# EAGLE design lcd-interface (EAGLE 5.02)
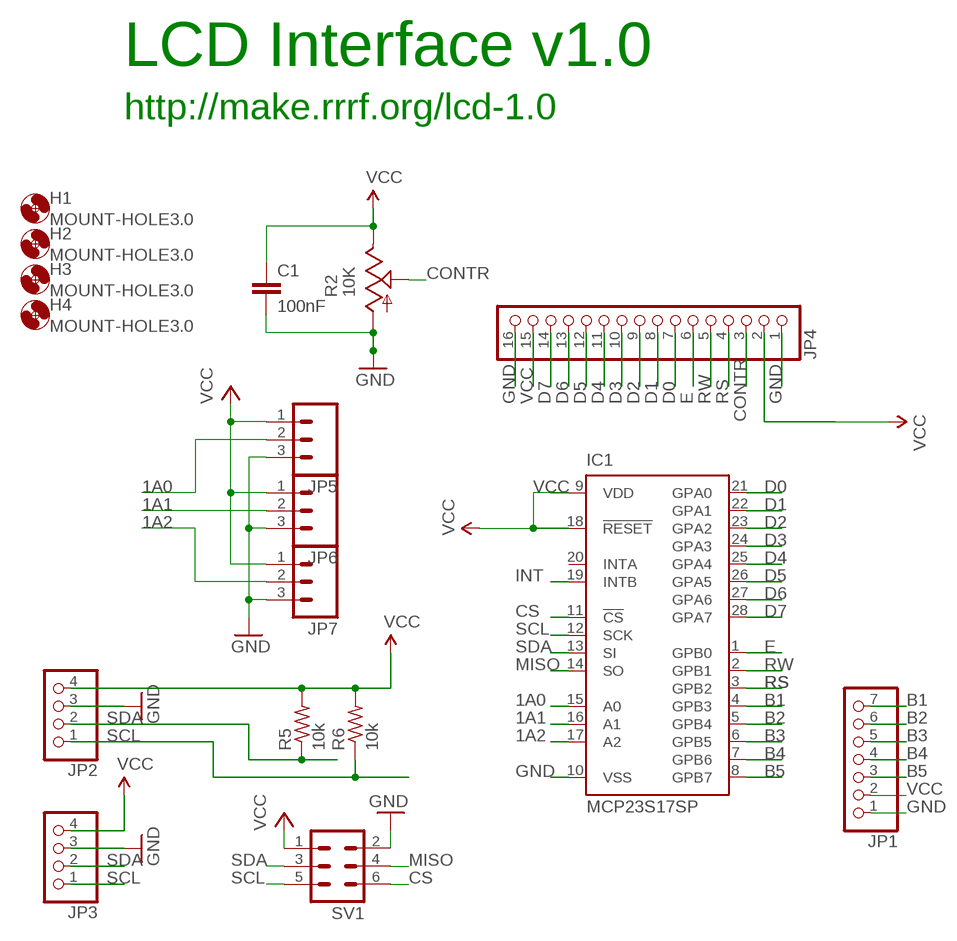
[diagram p0: schematic, sheet 1]

## Parts
C1  100nF  C-EU050-030X075  [C050-030X075]
H1  MOUNT-HOLE3.0  [3,0]
H2  MOUNT-HOLE3.0  [3,0]
H3  MOUNT-HOLE3.0  [3,0]
H4  MOUNT-HOLE3.0  [3,0]
IC1  MCP23S17SP  [DIL28-3]
JP1  PINHD-1X7  [1X07]
JP2  PINHD-1X4  [1X04]
JP3  PINHD-1X4  [1X04]
JP4  PINHD-1X16  [1X16]
JP5  M03PTH  [1X03]
JP6  M03PTH  [1X03]
JP7  M03PTH  [1X03]
R2  10K  TRIM_US-B25P  [B25P]
R5  10k  R-US_0207/7  [0207/7]
R6  10k  R-US_0207/7  [0207/7]
SV1  ML6  [ML6]

## Nets
1A0: IC1.15(A0) JP5.2
1A1: IC1.16(A1) JP6.2
1A2: IC1.17(A2) JP7.2
B1: IC1.4(GPB3) JP1.7
B2: IC1.5(GPB4) JP1.6
B3: IC1.6(GPB5) JP1.5
B4: IC1.7(GPB6) JP1.4
B5: IC1.8(GPB7) JP1.3
CONTR: JP4.3 R2.S
CS: IC1.11(!CS) SV1.6
D0: IC1.21(GPA0) JP4.7
D1: IC1.22(GPA1) JP4.8
D2: IC1.23(GPA2) JP4.9
D3: IC1.24(GPA3) JP4.10
D4: IC1.25(GPA4) JP4.11
D5: IC1.26(GPA5) JP4.12
D6: IC1.27(GPA6) JP4.13
D7: IC1.28(GPA7) JP4.14
E: IC1.1(GPB0) JP4.6
GND: C1.2 IC1.10(VSS) JP1.1 JP2.3 JP3.3 JP4.1 JP4.16 JP5.3 JP6.3 JP7.3 R2.A SV1.2
INT: IC1.19(INTB)
MISO: IC1.14(SO) SV1.4
RS: IC1.3(GPB2) JP4.4
RW: IC1.2(GPB1) JP4.5
SCL: IC1.12(SCK) JP2.1 JP3.1 R6.1 SV1.5
SDA: IC1.13(SI) JP2.2 JP3.2 R5.1 SV1.3
VCC: C1.1 IC1.9(VDD) IC1.18(!RESET) JP1.2 JP2.4 JP3.4 JP4.2 JP4.15 JP5.1 JP6.1 JP7.1 R2.E R5.2 R6.2 SV1.1
Unconnected: IC1.20(INTA)

## Notes on the sheet
- LCD Interface v1.0
- http://make.rrrf.org/lcd-1.0

## Library data of the parts
C1 = rcl:C-EU: CAPACITOR, European symbol
H1-H4 = holes:MOUNT-HOLE: MOUNTING HOLE with drill center marker
IC1 = microchip:MCP23S17: http://ww1.microchip.com/downloads/en/DeviceDoc/21952a.pdf Source: http://ww1.microchip.com/downloads/en/DeviceDoc/21952a.pdf
JP1 = pinhead:PINHD-1X7: PIN HEADER
JP2 JP3 = pinhead:PINHD-1X4: PIN HEADER
JP4 = pinhead:PINHD-1X16: PIN HEADER
JP5-JP7 = SparkFun:M03: Header 3 Standard 3-pin 0.1" header. Use with straight break away headers (SKU : PRT-00116), right angle break away headers (PRT-00553), swiss pins (PRT-00743), machine pins (PRT-00117), and female headers (PRT-00115). Molex polarized connector foot print use with SKU : PRT-08232 with associated crimp pins and housings.
R2 = pot:TRIM_US-: POTENTIOMETER
R5 R6 = resistor:R-US_: RESISTOR, American symbol
SV1 = con-harting-ml:ML6: HARTING

## Board
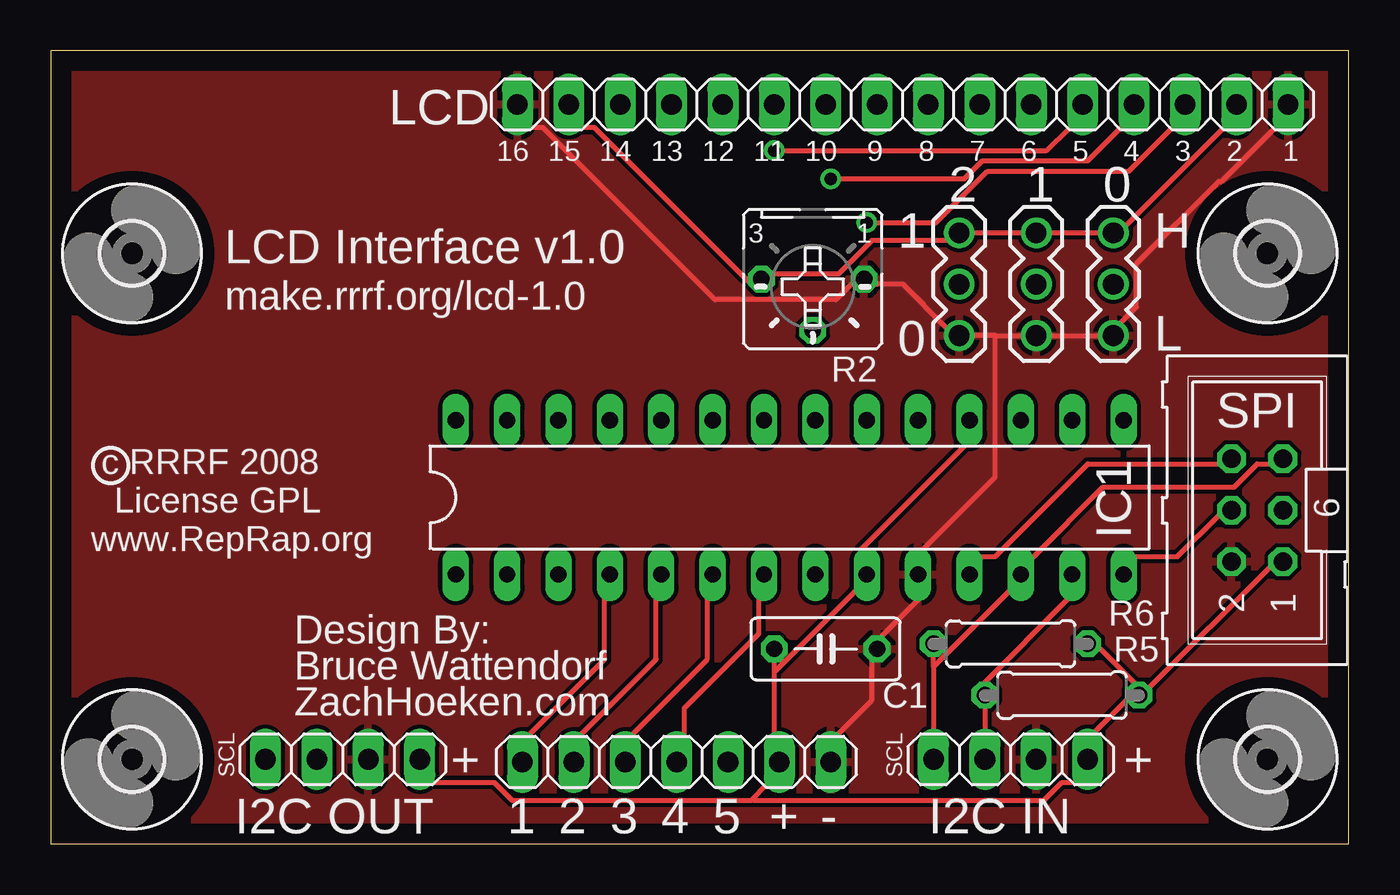
[diagram p1: board, top side]
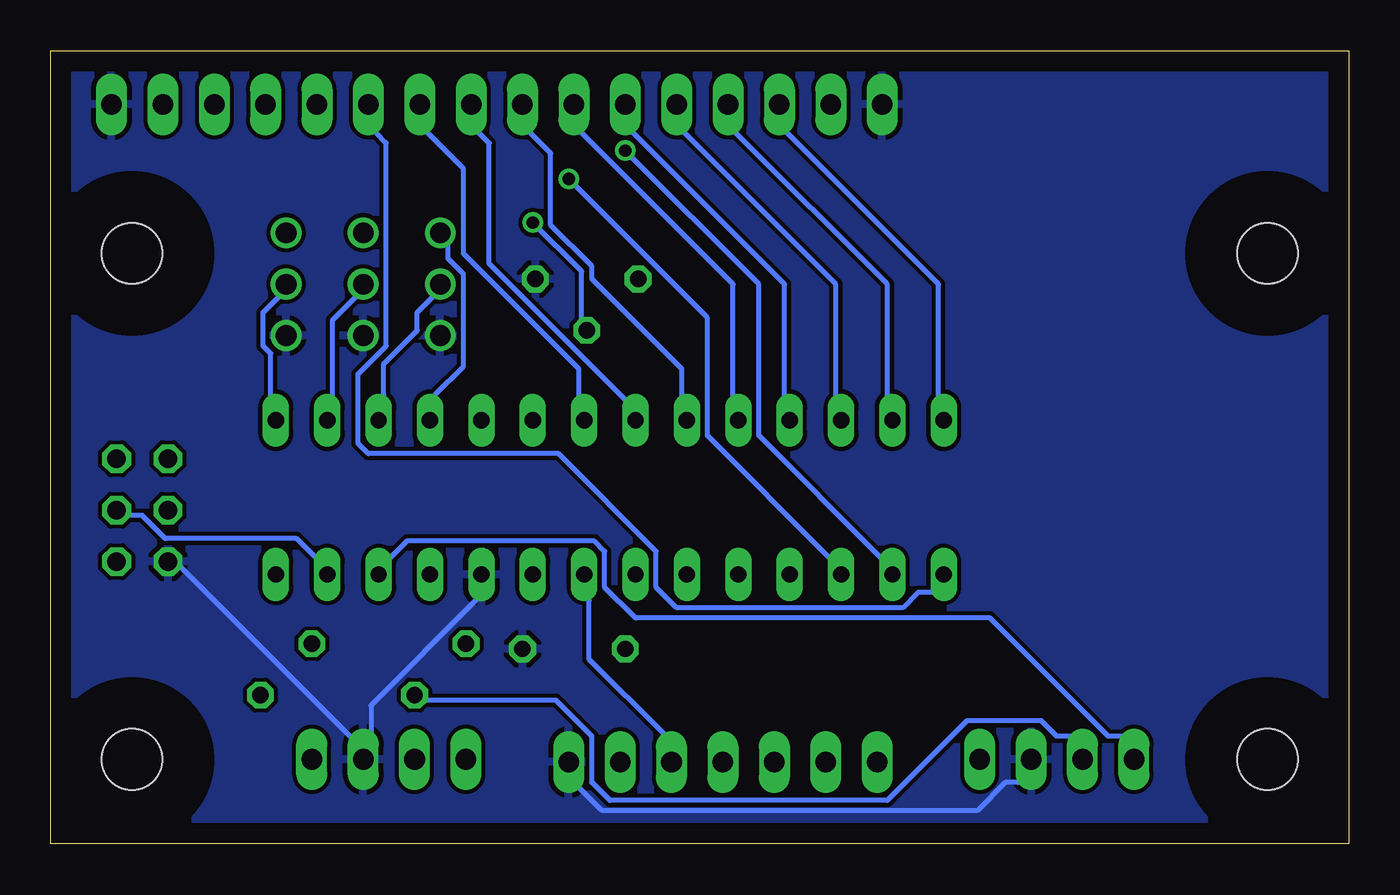
[diagram p2: board, bottom side, seen from below]

Size 64.19 x 39.23 mm. Coordinates in mm from the lower left corner, seen from the top.
Outline: 0,0 64.19,0 64.19,39.23 0,39.23 0,0
Copper layers (1*16): Top 0.035mm / dielectric 1.5mm / Bottom 0.035mm
Design rules "default": minimum track width 10mil, minimum drill 24mil, track to track 8mil, track to pad 8mil, pad to pad 8mil, via to via 8mil, smd to smd 8mil, copper to edge 40mil, drill to drill 8mil, minimum pad ring 10mil, minimum via ring 8mil, stop-mask expansion 4mil, vias tented up to drill 0mil, thermal gap 10mil

### Footprints (pad centres in the part's own frame; a part is rotated, then mirrored left to right if it is on the bottom)
C050-030X075 = drill 0.813 octagon: 1 -2.54,0; 2 2.54,0
3,0 = hole 3: 0,0
DIL28-3 = drill 0.813 long: 1 -16.51,-3.81; 2 -13.97,-3.81; 3 -11.43,-3.81; 4 -8.89,-3.81; 5 -6.35,-3.81; 6 -3.81,-3.81; 7 -1.27,-3.81; 8 1.27,-3.81; 9 3.81,-3.81; 10 6.35,-3.81; 11 8.89,-3.81; 12 11.43,-3.81; 13 13.97,-3.81; 14 16.51,-3.81; 15 16.51,3.81; 16 13.97,3.81; 17 11.43,3.81; 18 8.89,3.81; 19 6.35,3.81; 20 3.81,3.81; 21 1.27,3.81; 22 -1.27,3.81; 23 -3.81,3.81; 24 -6.35,3.81; 25 -8.89,3.81; 26 -11.43,3.81; 27 -13.97,3.81; 28 -16.51,3.81
1X07 = drill 1.016 long: 1 -7.62,0; 2 -5.08,0; 3 -2.54,0; 4 0,0; 5 2.54,0; 6 5.08,0; 7 7.62,0
1X04 = drill 1.016 long: 1 -3.81,0; 2 -1.27,0; 3 1.27,0; 4 3.81,0
1X16 = drill 1.016 long: 1 -19.05,0; 2 -16.51,0; 3 -13.97,0; 4 -11.43,0; 5 -8.89,0; 6 -6.35,0; 7 -3.81,0; 8 -1.27,0; 9 1.27,0; 10 3.81,0; 11 6.35,0; 12 8.89,0; 13 11.43,0; 14 13.97,0; 15 16.51,0; 16 19.05,0
1X03 = drill 1.016 round: 1 0,0; 2 2.54,0; 3 5.08,0
B25P = drill 0.813 octagon: A -2.54,0; E 2.54,0; S 0,2.54
0207/7 = drill 0.813 octagon: 1 -3.81,0; 2 3.81,0
ML6 = drill 0.914 octagon: 1 -2.54,-1.27; 2 -2.54,1.27; 3 0,-1.27; 4 0,1.27; 5 2.54,-1.27; 6 2.54,1.27

### Placement (x,y rotation side)
C1  38.32,9.65 0 top
H1  4.03,29.2 0 top
H2  4.03,4.19 0 top
H3  60.16,4.19 0 top
H4  60.16,29.2 0 top
IC1  36.54,17.14 0 top
JP1  30.95,4.06 180 top
JP2  47.46,4.19 0 top
JP3  14.44,4.19 0 top
JP4  42.13,36.57 180 top
JP5  52.54,30.22 270 top
JP6  48.73,30.22 270 top
JP7  44.92,30.22 270 top
R2  37.68,27.94 180 top
R5  50,7.36 0 top
R6  47.46,9.9 0 top
SV1  59.65,16.51 90 top

### Tracks (layer width: path | path; a pad name or v marks a point on that pad's centre or on a via)
1A0
  Bottom 0.254: IC1.15 53.3,22.22 53.3,24.25 53.68,24.63 53.68,26.28 52.92,27.05 JP5.2
1A1
  Bottom 0.254: IC1.16 50.25,22.22 50.25,25.9 49.11,27.05 JP6.2
1A2
  Bottom 0.254: IC1.17 47.71,22.22 47.71,23.74 46.06,25.4 46.06,26.28 45.3,27.05 JP7.2
B1
  Top 0.254: IC1.4 27.39,12.06 27.39,9.14 23.71,5.46 JP1.7
B2
  Top 0.254: IC1.5 29.93,12.06 29.93,9.14 26.25,5.46 JP1.6
B3
  Top 0.254: IC1.6 32.47,12.06 32.47,9.14 28.79,5.46 JP1.5
B4
  Top 0.254: IC1.7 35.01,12.06 35.01,10.41 31.33,6.73 31.33,5.46 JP1.4
B5
  Bottom 0.254: IC1.8 37.55,12.06 37.55,9.14 33.87,5.46 JP1.3
CONTR  (via drill 0.61)
  Top 0.254: v40.35,30.73 43.78,30.73 46.32,33.27 53.3,33.27 55.46,35.43 JP4.3
  Bottom 0.254: v40.35,30.73 37.94,28.32 37.94,26.03 R2.S
CS
  Top 0.254: IC1.11 46.06,14.22 46.7,14.22 51.27,18.79 57.75,18.79 SV1.6
D0
  Bottom 0.254: IC1.21 38.06,22.22 38.06,23.49 43.78,29.2 43.78,33.4 45.55,35.17 JP4.7
D1
  Bottom 0.254: IC1.22 35.78,21.97 42.51,28.7 42.51,34.67 43.02,35.17 JP4.8
D2
  Bottom 0.254: IC1.23 32.98,22.22 32.98,23.49 37.43,27.94 37.43,28.57 39.46,30.6 39.46,34.16 40.48,35.17 JP4.9
D3
  Bottom 0.254: IC1.24 30.44,22.22 30.44,27.68 37.94,35.17 JP4.10
D4
  Bottom 0.254: IC1.25 27.9,22.22 27.9,27.68 35.4,35.17 JP4.11
D5
  Bottom 0.254: IC1.26 25.36,22.22 25.36,27.68 32.85,35.17 JP4.12
D6
  Bottom 0.254: IC1.27 22.82,22.22 22.82,27.68 30.31,35.17 JP4.13
D7
  Bottom 0.254: IC1.28 20.28,22.22 20.28,27.68 27.77,35.17 JP4.14
E
  Bottom 0.254: IC1.1 20.66,12.44 21.3,12.44 22.06,11.68 33.24,11.68 34.25,12.69 34.25,14.47 39.08,19.3 48.48,19.3 48.98,19.81 48.98,23.24 47.59,24.63 47.59,34.67 48.09,35.17 JP4.6
GND
  Top 0.254: JP4.1 60.54,35.43 57.87,32.76 57.75,32.76 53.68,28.7 53.68,26.54 52.92,25.78 JP5.3 JP6.3 46.7,25.14 | JP4.16 23.71,35.43 24.35,35.43 32.85,26.92 38.82,26.92 39.59,27.68 R2.A 40.86,27.68 42.13,27.68 44.28,25.52 JP7.3 46.7,25.14 | JP1.1 38.95,5.46 40.6,7.11 40.6,9.01 C1.2 41.11,10.28 42.89,12.06 IC1.10 43.14,14.6 46.7,18.16 46.7,25.14
  Bottom 0.254: SV1.2 57.75,13.71 49.37,5.33 JP2.3 48.35,5.58 48.35,6.85 43.14,12.06 IC1.10 | JP3.3 16.34,3.04 16.98,3.04 18.38,1.65 36.92,1.65 38.06,2.79 JP1.1
  pour Bottom: -0.16,39.75 64.61,39.75 64.61,-0.26 -0.16,-0.26
  pour Top: -0.16,39.75 64.61,39.75 64.61,-0.26 -0.16,-0.26
MISO
  Top 0.254: IC1.14 53.68,14.22 55.71,14.22 57.75,16.25 SV1.4
RS  (via drill 0.61)
  Top 0.254: v38.57,32.89 45.17,32.89 46.06,33.78 51.27,33.78 52.92,35.43 JP4.4
  Bottom 0.254: v38.57,32.89 31.71,26.03 31.71,20.19 25.74,14.22 IC1.3
RW  (via drill 0.61)
  Top 0.254: v35.78,34.29 49.24,34.29 50.38,35.43 JP4.5
  Bottom 0.254: v35.78,34.29 29.17,27.68 29.17,20.19 23.2,14.22 IC1.2
SCL
  Top 0.254: 43.65,8.76 R6.1 | 43.65,8.76 JP2.1 | 43.65,8.76 47.33,12.44 IC1.12 48.6,14.22 52.03,17.65 58.51,17.65 59.65,18.79 60.29,18.79 SV1.5
  Bottom 0.254: JP3.1 11.27,5.33 11.9,5.33 17.74,11.17 35.27,11.17 36.79,12.69 36.79,14.47 37.3,14.98 46.57,14.98 47.33,14.22 IC1.12
SDA
  Top 0.254: JP2.2 R5.1 46.19,8 50.25,12.06 IC1.13
  Bottom 0.254: SV1.3 60.29,16.25 59.65,16.25 58.51,15.11 52.03,15.11 51.14,14.22 IC1.13 | JP3.2 13.8,5.33 14.44,5.33 15.2,6.09 18.88,6.09 22.82,2.15 36.54,2.15 37.43,3.04 37.43,5.33 39.2,7.11 45.55,7.11 R5.1
VCC
  Top 0.254: JP4.2 58,35.43 53.17,30.6 JP5.1 JP6.1 JP7.1 44.28,29.84 40.6,29.84 38.95,28.19 35.78,28.19 R2.E 34.51,27.81 26.89,35.43 26.25,35.43 JP4.15 | R5.2 53.17,7.11 51.65,5.58 JP2.4 50.63,3.04 50,3.04 49.11,2.15 34.76,2.15 34.7,2.22 | R6.2 51.91,9.65 53.56,8 R5.2 | SV1.1 60.29,13.71 54.32,7.74 R5.2 | 35.78,8.5 35.78,5.46 JP1.2 35.4,2.92 34.7,2.22 | 35.78,8.5 C1.1 | 35.78,8.5 39.71,12.44 IC1.9 40.09,14.6 45.17,19.68 IC1.18 | 34.7,2.22 34.63,2.15 22.82,2.15 21.93,3.04 18.88,3.04 JP3.4
  Bottom 0.254: JP7.1 44.54,29.59 44.54,28.95 43.78,28.19 43.78,23.62 45.17,22.22 IC1.18

### Text on the board
tPlace: LCD | 16 | 15 | 14 | 13 | 12 | 11 | 10 | 9 | 8 | 7 | 6 | 5 | 4 | 3 | 2 | 1 | 2 | 1 | 0 | 1 | H | LCD Interface v1.0 | make.rrrf.org/lcd-1.0 | L | 0 | SPI | c RRRF 2008 | License GPL | www.RepRap.org | Design By: | Bruce Wattendorf | ZachHoeken.com | SCL | + | SCL | + | I2C OUT | 1 | 2 | 3 | 4 | 5 | + | - | I2C IN